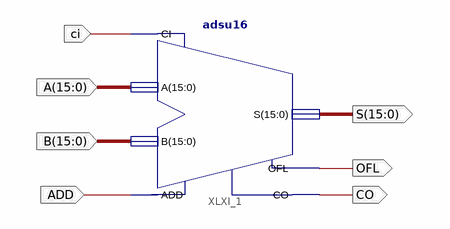
[diagram p0: schematic sheet 1]
// Xilinx ISE schematic ADD16.sch (spartan6) as structural Verilog: 1 symbols, 7 ports
module ADD16 (
  input  ci,
  input  [15:0] A,
  input  [15:0] B,
  input  ADD,
  output [15:0] S,
  output OFL,
  output CO
);

  adsu16 XLXI_1 (.A(A), .ADD(ADD), .B(B), .CI(ci), .CO(CO), .OFL(OFL), .S(S));
endmodule
